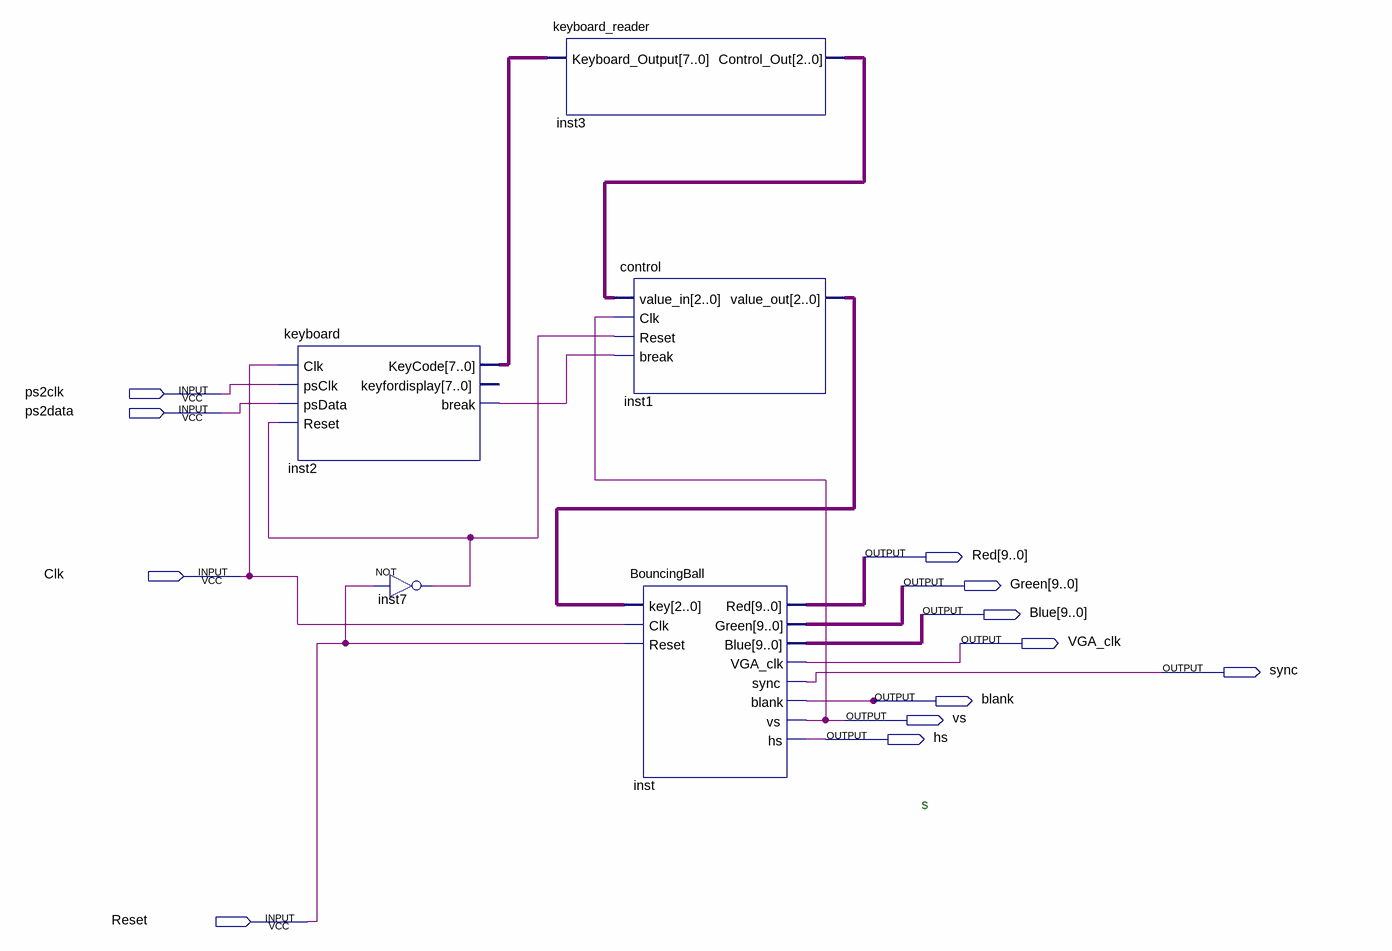
[diagram p0: schematic sheet]
// Quartus schematic lab9block.bdf as structural Verilog: 5 symbols, 12 pins
module lab9block (
  input  ps2clk,
  input  ps2data,
  input  Clk,
  input  Reset,
  output [9:0] Red,
  output [9:0] Green,
  output [9:0] Blue,
  output VGA_clk,
  output sync,
  output blank,
  output vs,
  output hs
);

  wire inst2_break, inst7_out;
  wire [2:0] inst1_value_out, inst3_control_out;
  wire [7:0] inst2_keycode;

  keyboard inst2 (
    .Clk(Clk), .psClk(ps2clk), .psData(ps2data), .Reset(inst7_out), .KeyCode(inst2_keycode),
    .\break (inst2_break));  // open: keyfordisplay
  not inst7 (inst7_out, Reset);
  keyboard_reader inst3 (.Keyboard_Output(inst2_keycode), .Control_Out(inst3_control_out));
  control inst1 (
    .value_in(inst3_control_out), .Clk(vs), .Reset(inst7_out), .\break (inst2_break),
    .value_out(inst1_value_out));
  BouncingBall inst (
    .key(inst1_value_out), .Clk(Clk), .Reset(Reset), .Red(Red), .Green(Green), .Blue(Blue),
    .VGA_clk(VGA_clk), .sync(sync), .blank(blank), .vs(vs), .hs(hs));

  // Notes on the sheet:
  //   s
endmodule
